# Altium schematic sheet Sheet1.SchDoc
size A3; SheetNumber: 1; SheetTotal: 1
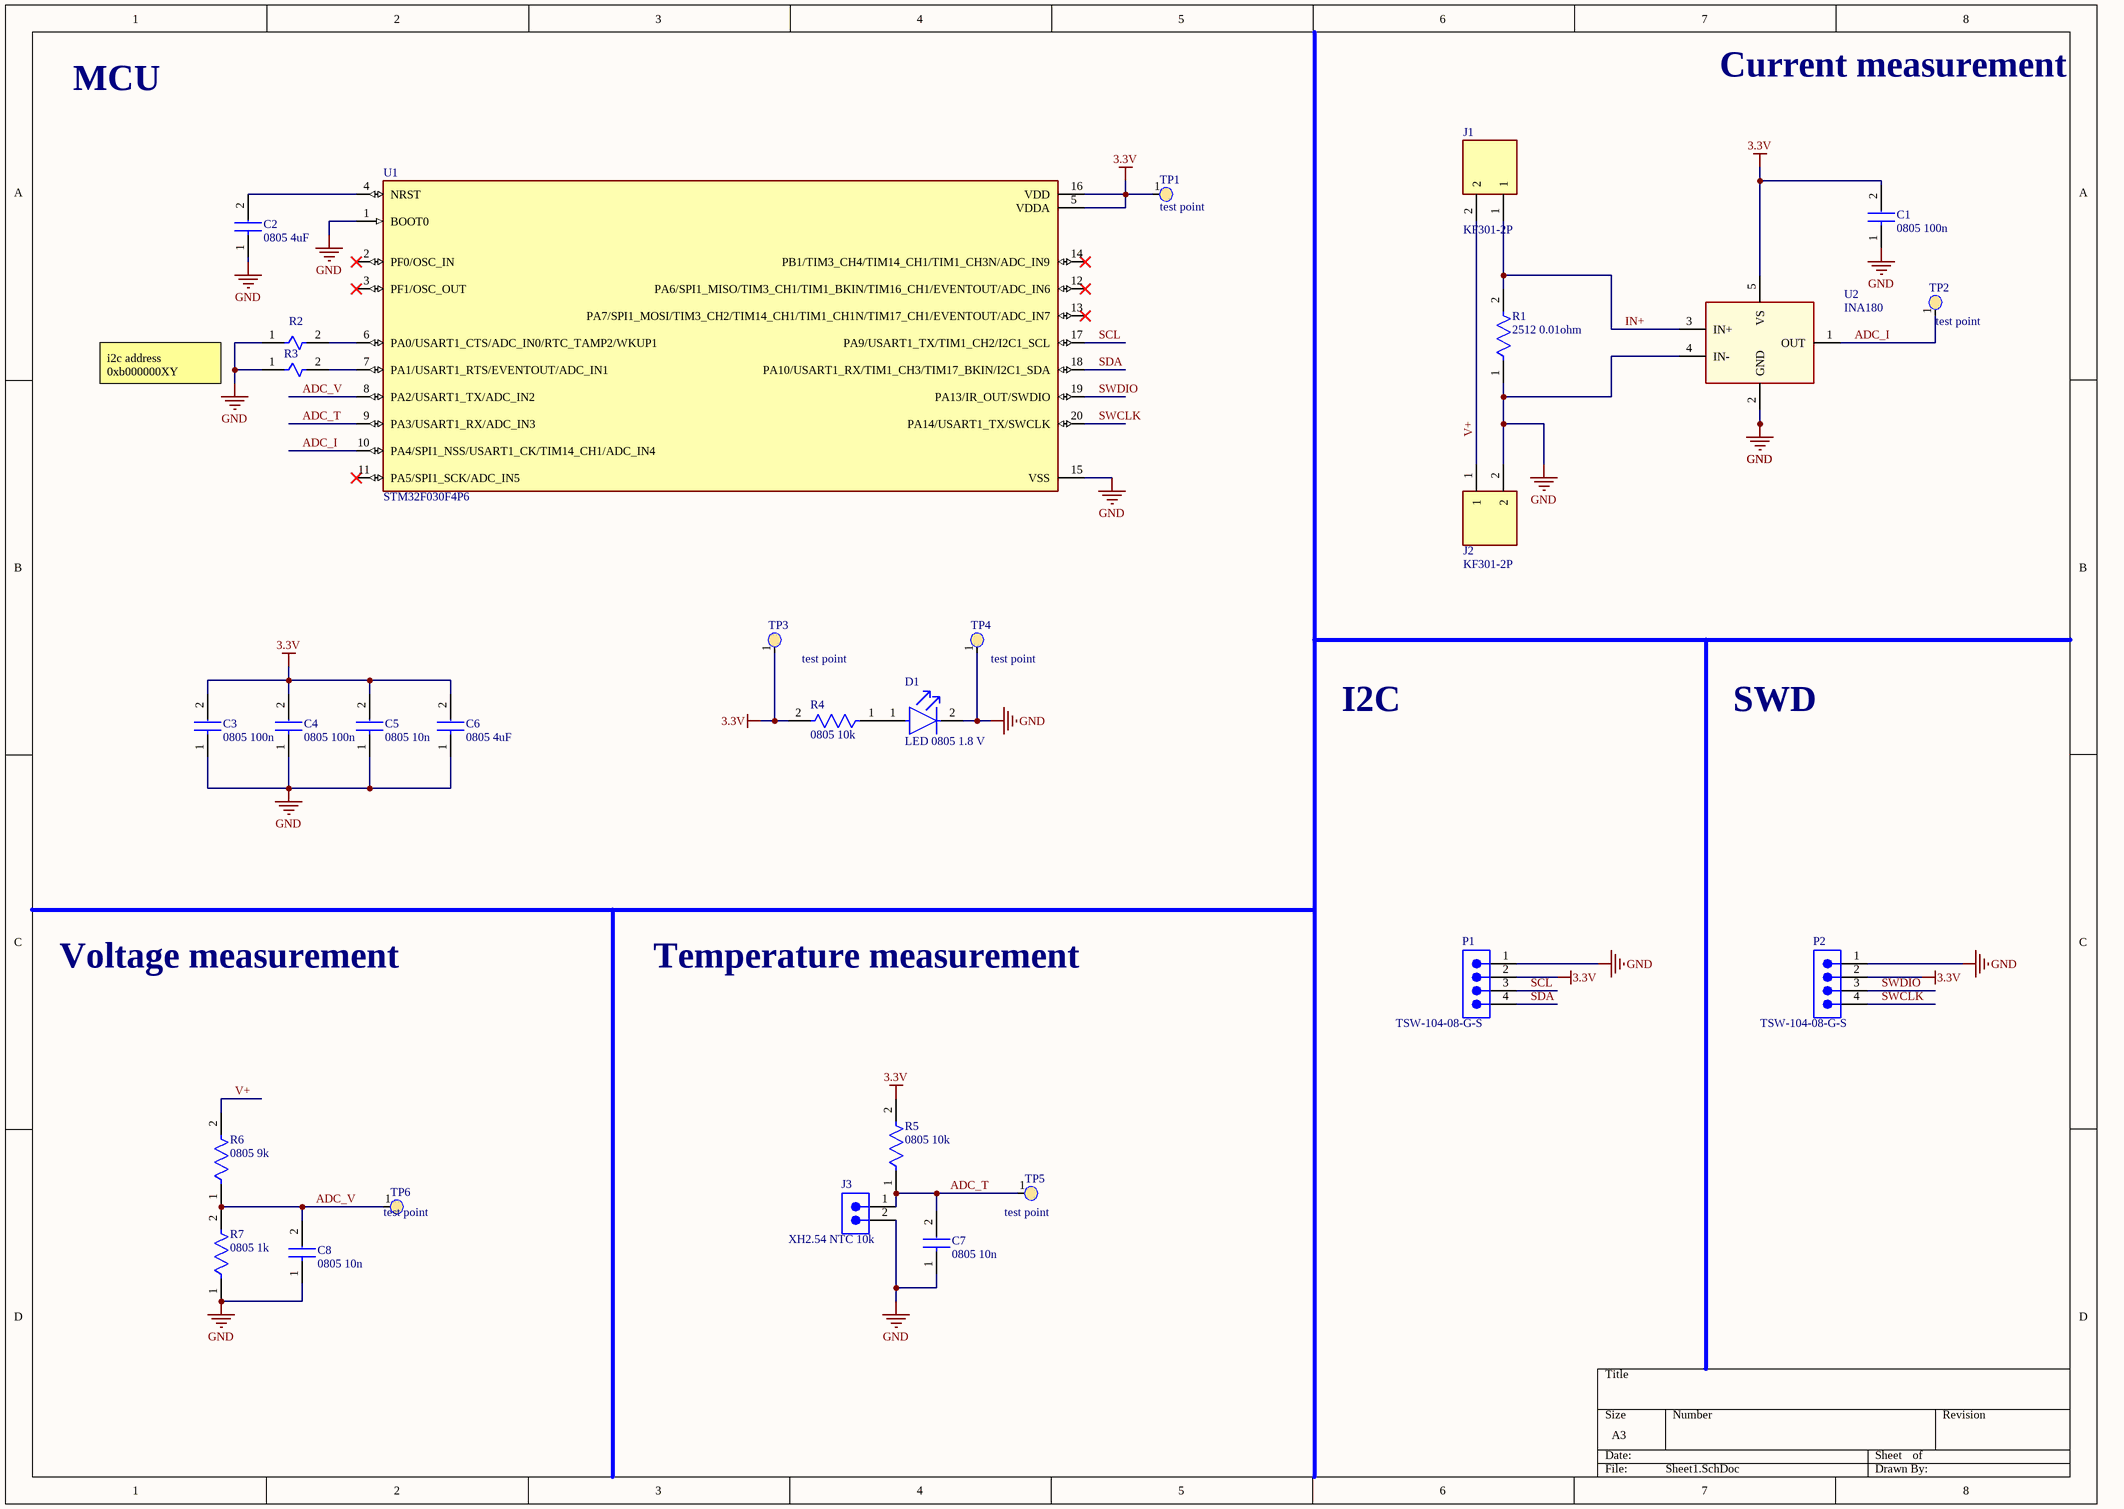
[diagram p0: Sheet1.SchDoc]

## Parts
C1  0805 100n  [CAP 0805 IPC_A]
C2  0805 4uF  [CAP 0805 IPC_A]
C3  0805 100n  [CAP 0805 IPC_A]
C4  0805 100n  [CAP 0805 IPC_A]
C5  0805 10n  [CAP 0805 IPC_A]
C6  0805 4uF  [CAP 0805 IPC_A]
C7  0805 10n  [CAP 0805 IPC_A]
C8  0805 10n  [CAP 0805 IPC_A]
D1  LED 0805 1.8 V  [LED-0805- MFG]
J1  KF301-2P  [KF301]
J2  KF301-2P  [KF301]
J3  XH2.54 NTC 10k  [B2B-XH-A_LF_SN-MFG]
P1  TSW-104-08-G-S  [header4pin]
P2  TSW-104-08-G-S  [header4pin]
R1  2512 0.01ohm  [R 2512 A]
R2  0603  [0603-IPC_C]  (value not drawn)
R3  0603  [0603-IPC_C]  (value not drawn)
R4  0805 10k  [R 0805 A]
R5  0805 10k  [R 0805 A]
R6  0805 9k  [R 0805 A]
R7  0805 1k  [R 0805 A]
TP1  test point  [testpoint]
TP2  test point  [testpoint]
TP3  test point  [testpoint]
TP4  test point  [testpoint]
TP5  test point  [testpoint]
TP6  test point  [testpoint]
U1  STM32F030F4P6  [STM32F030 - 20pin]
U2  INA180  [INA180]

## Nets
3.3V: C1.2 C3.2 C4.2 C5.2 C6.2 P1.2 P2.2 R4.2 R5.2 TP1.1(testpoint) TP3.1(testpoint) U1.5(VDDA) U1.16(VDD) U2.5(VS)
GND: C1.1 C2.1 C3.1 C4.1 C5.1 C6.1 C7.1 C8.1 D1.2(C) J2.2 J3.2 P1.1 P2.1 R1.1 R2.1 R3.1 R7.1 TP4.1(testpoint) U1.1(BOOT0) U1.15(VSS) U2.2(GND) U2.4(IN-)
ADC_I: TP2.1(testpoint) U1.10(PA4/SPI1_NSS/USART1_CK/TIM14_CH1/ADC_IN4) U2.1(OUT)
ADC_T: C7.2 J3.1 R5.1 TP5.1(testpoint) U1.9(PA3/USART1_RX/ADC_IN3)
ADC_V: C8.2 R6.1 R7.2 TP6.1(testpoint) U1.8(PA2/USART1_TX/ADC_IN2)
IN+: J1.1 R1.2 U2.3(IN+)
SCL: P1.3 U1.17(PA9/USART1_TX/TIM1_CH2/I2C1_SCL)
SDA: P1.4 U1.18(PA10/USART1_RX/TIM1_CH3/TIM17_BKIN/I2C1_SDA)
SWCLK: P2.4 U1.20(PA14/USART1_TX/SWCLK)
SWDIO: P2.3 U1.19(PA13/IR_OUT/SWDIO)
V+: J1.2 J2.1 R6.2
NetC2_2: C2.2 U1.4(NRST)
NetD1_1: D1.1(A) R4.1
NetR2_2: R2.2 U1.6(PA0/USART1_CTS/ADC_IN0/RTC_TAMP2/WKUP1)
NetR3_2: R3.2 U1.7(PA1/USART1_RTS/EVENTOUT/ADC_IN1)

Not connected (* = marked no-connect by the designer): U1 2(PF0/OSC_IN)* 3(PF1/OSC_OUT)* 11(PA5/SPI1_SCK/ADC_IN5)* 12(PA6/SPI1_MISO/TIM3_CH1/TIM1_BKIN/TIM16_CH1/EVENTOUT/ADC_IN6)* 13(PA7/SPI1_MOSI/TIM3_CH2/TIM14_CH1/TIM1_CH1N/TIM17_CH1/EVENTOUT/ADC_IN7)* 14(PB1/TIM3_CH4/TIM14_CH1/TIM1_CH3N/ADC_IN9)*

## Notes on the sheet
- MCU
- Current measurement
- i2c address
  0xb000000XY
- I2C
- SWD
- Voltage measurement
- Temperature measurement

## Library data of the parts
C1-C8 = CAP: Chip Multilayer Ceramic Capacitors for General Purpose, 0805, 2200pF, C0G, 30ppm/°C, 5%, 250V; Capacitance: 2.2nF; Width: 1.25mm; Dielectric: C0G; Voltage Rating (DC): 250V; Tolerance: 5%; Thickness: 1mm; Length: 2mm
D1 = led 0805: LED BLUE CLEAR 0805 SMD; Dominant Wavelength: 470nm; Forward Voltage: 3.3V; Forward Current: 20mA; Lens Color: Colorless; Lens Style: Rectangular; Luminous Intensity: 115mcd; Viewing Angle: 130°; Power Rating: 100mW; Lens Transparency: Clear; Height: 1.1mm; Mount: Surface Mount; Packaging: Tape and Reel; Package Quantity: 3000; Illumination Color: Blue; Width: 1.2mm; Min Operating Temperature: -30°C; Case Code (Imperial): 0805; Length: 2mm; Test Current: 20mA; Max Operating Temperature: 80°C; Case Code (Metric): 2012; Color: Blue; Wavelength: 470nm; Case/Package: 0805; Lead Free: Lead Free; Number of Pins: 2
J1 J2 = KF301-2P: 2 Pin Terminal Block 5mm Pitch; MF: Handson Technology; SnapEDA_Link: https://www.snapeda.com/parts/KF301-2P/Handson+Technology/view-part/?ref=snap; Package: None; Value: *; MP: KF301-2P; Check_prices: https://www.snapeda.com/parts/KF301-2P/Handson+Technology/view-part/?ref=eda
J3 = XH2.54 2 pin: CONN HEADER VERT 2POS 2.5MM; Current Rating: 3A; Voltage Rating: 250V; Number of Contacts: 2; Contact Resistance: 20mR; Wire/Cable Gauge: 22AWG; Insulation Resistance: 1GR; Connector Type: Male Pin; Packaging: Bulk; Contact Material: Brass; Lead Free: Lead Free; Orientation: Straight; Contact Plating: Tin; Max Current Rating: 3A; Termination: Solder; Fastening Type: Detent; Depth: 5.75mm; Housing Material: Polyamide; REACH SVHC: No SVHC; Series: XH; Voltage Rating (AC): 250V; Number of Positions: 2; Color: Natural; Contact Type: Male Pin; Max Voltage Rating (DC): 250V; Pitch: 2.5mm; Lead Pitch: 2.5mm; Mount: Through Hole; Max Operating Temperature: 85°C; Length: 7.4mm; Max Voltage Rating (AC): 250V; Min Operating Temperature: -25°C; Number of Rows: 1; Housing Color: White
P1 P2 = header4pin: 0.025" SQ Post Header, Through-hole, Vertical, -55 to 125 degC, 2.54 mm Pitch, 4-Pin, Male, RoHS; Manufacturer: Samtec; Pitch: 2.54 mm; RoHS: True; ComponentLink3URL: http://www.samtec.com/documents/webfiles/cpdf/TSW-XXX-XX-XXX-X-XX-XXX-MKT.pdf; Mounting Technology: Through-hole; ComponentLink2URL: http://www.samtec.com/documents/webfiles/pdf/TSW_TH.PDF; ComponentLink1URL: http://www.samtec.com; ComponentLink3Description: Package Specification; PackageVersion: DM, 8/1988; ComponentLink2Description: Datasheet; PackageReference: TSW-104-08-X-S; PackageDescription: .025[0.64] SQ. Post Terminal Strip Assembly; PartNumber: TSW-104-08-G-S; ComponentLink1Description: Manufacturer URL; Temperature Range: -55 to 125 degC; DatasheetVersion: F-214; Orientation: Vertical
R1 = R 2512: Resistance: 0mR; Radiation Hardening: No; Case Code (Imperial): 0805; Number of Terminations: 2; Lead Free: Lead Free; Max Operating Temperature: 155°C; Width: 0.049inch; Case Code (Metric): 2012; Height: 0.026inch; Mount: Surface Mount; Min Operating Temperature: -55°C; Packaging: Tape and Reel; Package Quantity: 1; Termination: Wraparound; Length: 0.079inch; RoHS Compliant: Yes; Case/Package: 0805
R4-R7 = R 0805: Resistance: 0mR; Radiation Hardening: No; Case Code (Imperial): 0805; Number of Terminations: 2; Lead Free: Lead Free; Max Operating Temperature: 155°C; Width: 0.049inch; Case Code (Metric): 2012; Height: 0.026inch; Mount: Surface Mount; Min Operating Temperature: -55°C; Packaging: Tape and Reel; Package Quantity: 1; Termination: Wraparound; Length: 0.079inch; RoHS Compliant: Yes; Case/Package: 0805
TP1-TP6 = testpoint: Value: test point
U1 = STM32F030F4P6: ARMÂ® CortexÂ®-M0 STM32F0 Microcontroller IC 32-Bit Single-Core 48MHz 16KB (16K x 8) FLASH; MF: STMicroelectronics; SnapEDA_Link: https://www.snapeda.com/parts/STM32F030F4P6/STMicroelectronics/view-part/?ref=snap; Package: TSSOP-20 STMicroelectronics; Value: *; MP: STM32F030F4P6; Check_prices: https://www.snapeda.com/parts/STM32F030F4P6/STMicroelectronics/view-part/?ref=eda
U2 = INA180: 26V, 350kHz current sense amplifier; MF: Texas Instruments; MP: INA180B1IDBVT; SnapEDA_Link: https://www.snapeda.com/parts/INA180B1IDBVT/Texas+Instruments/view-part/?ref=snap; Package: SOT-23-5 Texas Instruments; Value: *; Check_prices: https://www.snapeda.com/parts/INA180B1IDBVT/Texas+Instruments/view-part/?ref=eda